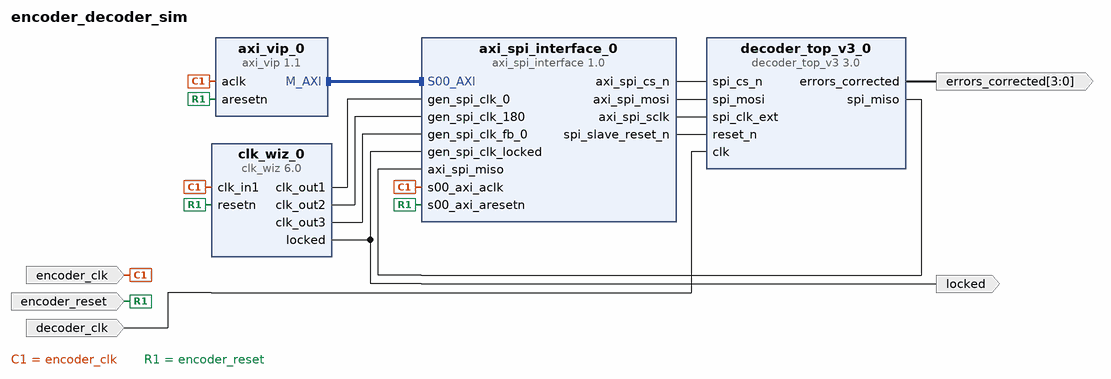
[diagram p0: block diagram of the top level]
# Vivado block design encoder_decoder_sim, xc7z020clg400-1, Vivado 2022.1
create_bd_design encoder_decoder_sim

create_bd_port -dir I -type clk decoder_clk
set_property -dict {CONFIG.FREQ_HZ 100000000} [get_bd_ports decoder_clk]
create_bd_port -dir I -type clk encoder_clk
set_property -dict {CONFIG.ASSOCIATED_RESET encoder_reset CONFIG.FREQ_HZ 100000000} [get_bd_ports encoder_clk]
create_bd_port -dir I -type rst encoder_reset
create_bd_port -dir O -from 3 -to 0 -type data errors_corrected
create_bd_port -dir O -type data locked

create_bd_cell -type ip -vlnv xilinx.com:ip:axi_vip:1.1 axi_vip_0
set_property -dict [list \
  CONFIG.ADDR_WIDTH 32 \
  CONFIG.DATA_WIDTH 32 \
  CONFIG.HAS_BRESP 1 \
  CONFIG.HAS_PROT 1 \
  CONFIG.HAS_RRESP 1 \
  CONFIG.HAS_WSTRB 1 \
  CONFIG.INTERFACE_MODE MASTER \
  CONFIG.PROTOCOL AXI4LITE \
  CONFIG.READ_WRITE_MODE READ_WRITE \
] [get_bd_cells axi_vip_0]
create_bd_cell -type ip -vlnv xilinx.com:ip:clk_wiz:6.0 clk_wiz_0
set_property -dict [list \
  CONFIG.CLKOUT1_JITTER 151.636 \
  CONFIG.CLKOUT1_PHASE_ERROR 98.575 \
  CONFIG.CLKOUT1_REQUESTED_OUT_FREQ 50.000 \
  CONFIG.CLKOUT2_JITTER 151.636 \
  CONFIG.CLKOUT2_PHASE_ERROR 98.575 \
  CONFIG.CLKOUT2_REQUESTED_OUT_FREQ 50.000 \
  CONFIG.CLKOUT2_REQUESTED_PHASE 180.000 \
  CONFIG.CLKOUT2_USED true \
  CONFIG.CLKOUT3_JITTER 151.636 \
  CONFIG.CLKOUT3_PHASE_ERROR 98.575 \
  CONFIG.CLKOUT3_REQUESTED_OUT_FREQ 50.000 \
  CONFIG.CLKOUT3_REQUESTED_PHASE 0.000 \
  CONFIG.CLKOUT3_USED true \
  CONFIG.CLKOUT4_JITTER 151.636 \
  CONFIG.CLKOUT4_PHASE_ERROR 98.575 \
  CONFIG.CLKOUT4_REQUESTED_OUT_FREQ 50.000 \
  CONFIG.CLKOUT4_REQUESTED_PHASE 270.000 \
  CONFIG.CLKOUT4_USED false \
  CONFIG.MMCM_CLKFBOUT_MULT_F 10.000 \
  CONFIG.MMCM_CLKOUT0_DIVIDE_F 20.000 \
  CONFIG.MMCM_CLKOUT1_DIVIDE 20 \
  CONFIG.MMCM_CLKOUT1_PHASE 180.000 \
  CONFIG.MMCM_CLKOUT2_DIVIDE 20 \
  CONFIG.MMCM_CLKOUT2_PHASE 0.000 \
  CONFIG.MMCM_CLKOUT3_DIVIDE 1 \
  CONFIG.MMCM_CLKOUT3_PHASE 270.000 \
  CONFIG.NUM_OUT_CLKS 3 \
  CONFIG.PRIM_IN_FREQ 100.000 \
  CONFIG.RESET_PORT resetn \
  CONFIG.RESET_TYPE ACTIVE_LOW \
] [get_bd_cells clk_wiz_0]
create_bd_cell -type ip -vlnv xilinx.com:user:axi_spi_interface:1.0 axi_spi_interface_0
set_property -dict {CONFIG.SPI_RD_ADDR_WIDTH 5} [get_bd_cells axi_spi_interface_0]
create_bd_cell -type ip -vlnv xilinx.com:user:decoder_top_v3:3.0 decoder_top_v3_0
set_property -dict {CONFIG.COMMS_DEBUG true CONFIG.SPI_RD_ADDR_WIDTH 5} [get_bd_cells decoder_top_v3_0]

# ---- connections ----

connect_bd_intf_net [get_bd_intf_pins axi_vip_0/M_AXI] [get_bd_intf_pins axi_spi_interface_0/S00_AXI]
connect_bd_net [get_bd_pins axi_spi_interface_0/axi_spi_cs_n] [get_bd_pins decoder_top_v3_0/spi_cs_n]
connect_bd_net [get_bd_pins axi_spi_interface_0/axi_spi_mosi] [get_bd_pins decoder_top_v3_0/spi_mosi]
connect_bd_net [get_bd_pins axi_spi_interface_0/axi_spi_sclk] [get_bd_pins decoder_top_v3_0/spi_clk_ext]
connect_bd_net [get_bd_pins axi_spi_interface_0/spi_slave_reset_n] [get_bd_pins decoder_top_v3_0/reset_n]
connect_bd_net [get_bd_pins clk_wiz_0/clk_out1] [get_bd_pins axi_spi_interface_0/gen_spi_clk_0]
connect_bd_net [get_bd_pins clk_wiz_0/clk_out2] [get_bd_pins axi_spi_interface_0/gen_spi_clk_180]
connect_bd_net [get_bd_pins clk_wiz_0/clk_out3] [get_bd_pins axi_spi_interface_0/gen_spi_clk_fb_0]
connect_bd_net [get_bd_pins clk_wiz_0/locked] [get_bd_ports locked] [get_bd_pins axi_spi_interface_0/gen_spi_clk_locked]
connect_bd_net [get_bd_ports decoder_clk] [get_bd_pins decoder_top_v3_0/clk]
connect_bd_net [get_bd_pins decoder_top_v3_0/errors_corrected] [get_bd_ports errors_corrected]
connect_bd_net [get_bd_pins decoder_top_v3_0/spi_miso] [get_bd_pins axi_spi_interface_0/axi_spi_miso]
connect_bd_net [get_bd_ports encoder_clk] [get_bd_pins axi_vip_0/aclk] [get_bd_pins clk_wiz_0/clk_in1] [get_bd_pins axi_spi_interface_0/s00_axi_aclk]
connect_bd_net [get_bd_ports encoder_reset] \
  [get_bd_pins axi_vip_0/aresetn] [get_bd_pins clk_wiz_0/resetn] [get_bd_pins axi_spi_interface_0/s00_axi_aresetn]

# ---- address map ----
assign_bd_address -offset 0x44A00000 -range 64K -target_address_space [get_bd_addr_spaces axi_vip_0/Master_AXI] [get_bd_addr_segs axi_spi_interface_0/S00_AXI/S00_AXI_reg]

validate_bd_design
save_bd_design
